# EAGLE design DAC Shield Rev B (EAGLE 9.6.2)

## Sheet 1 of 2
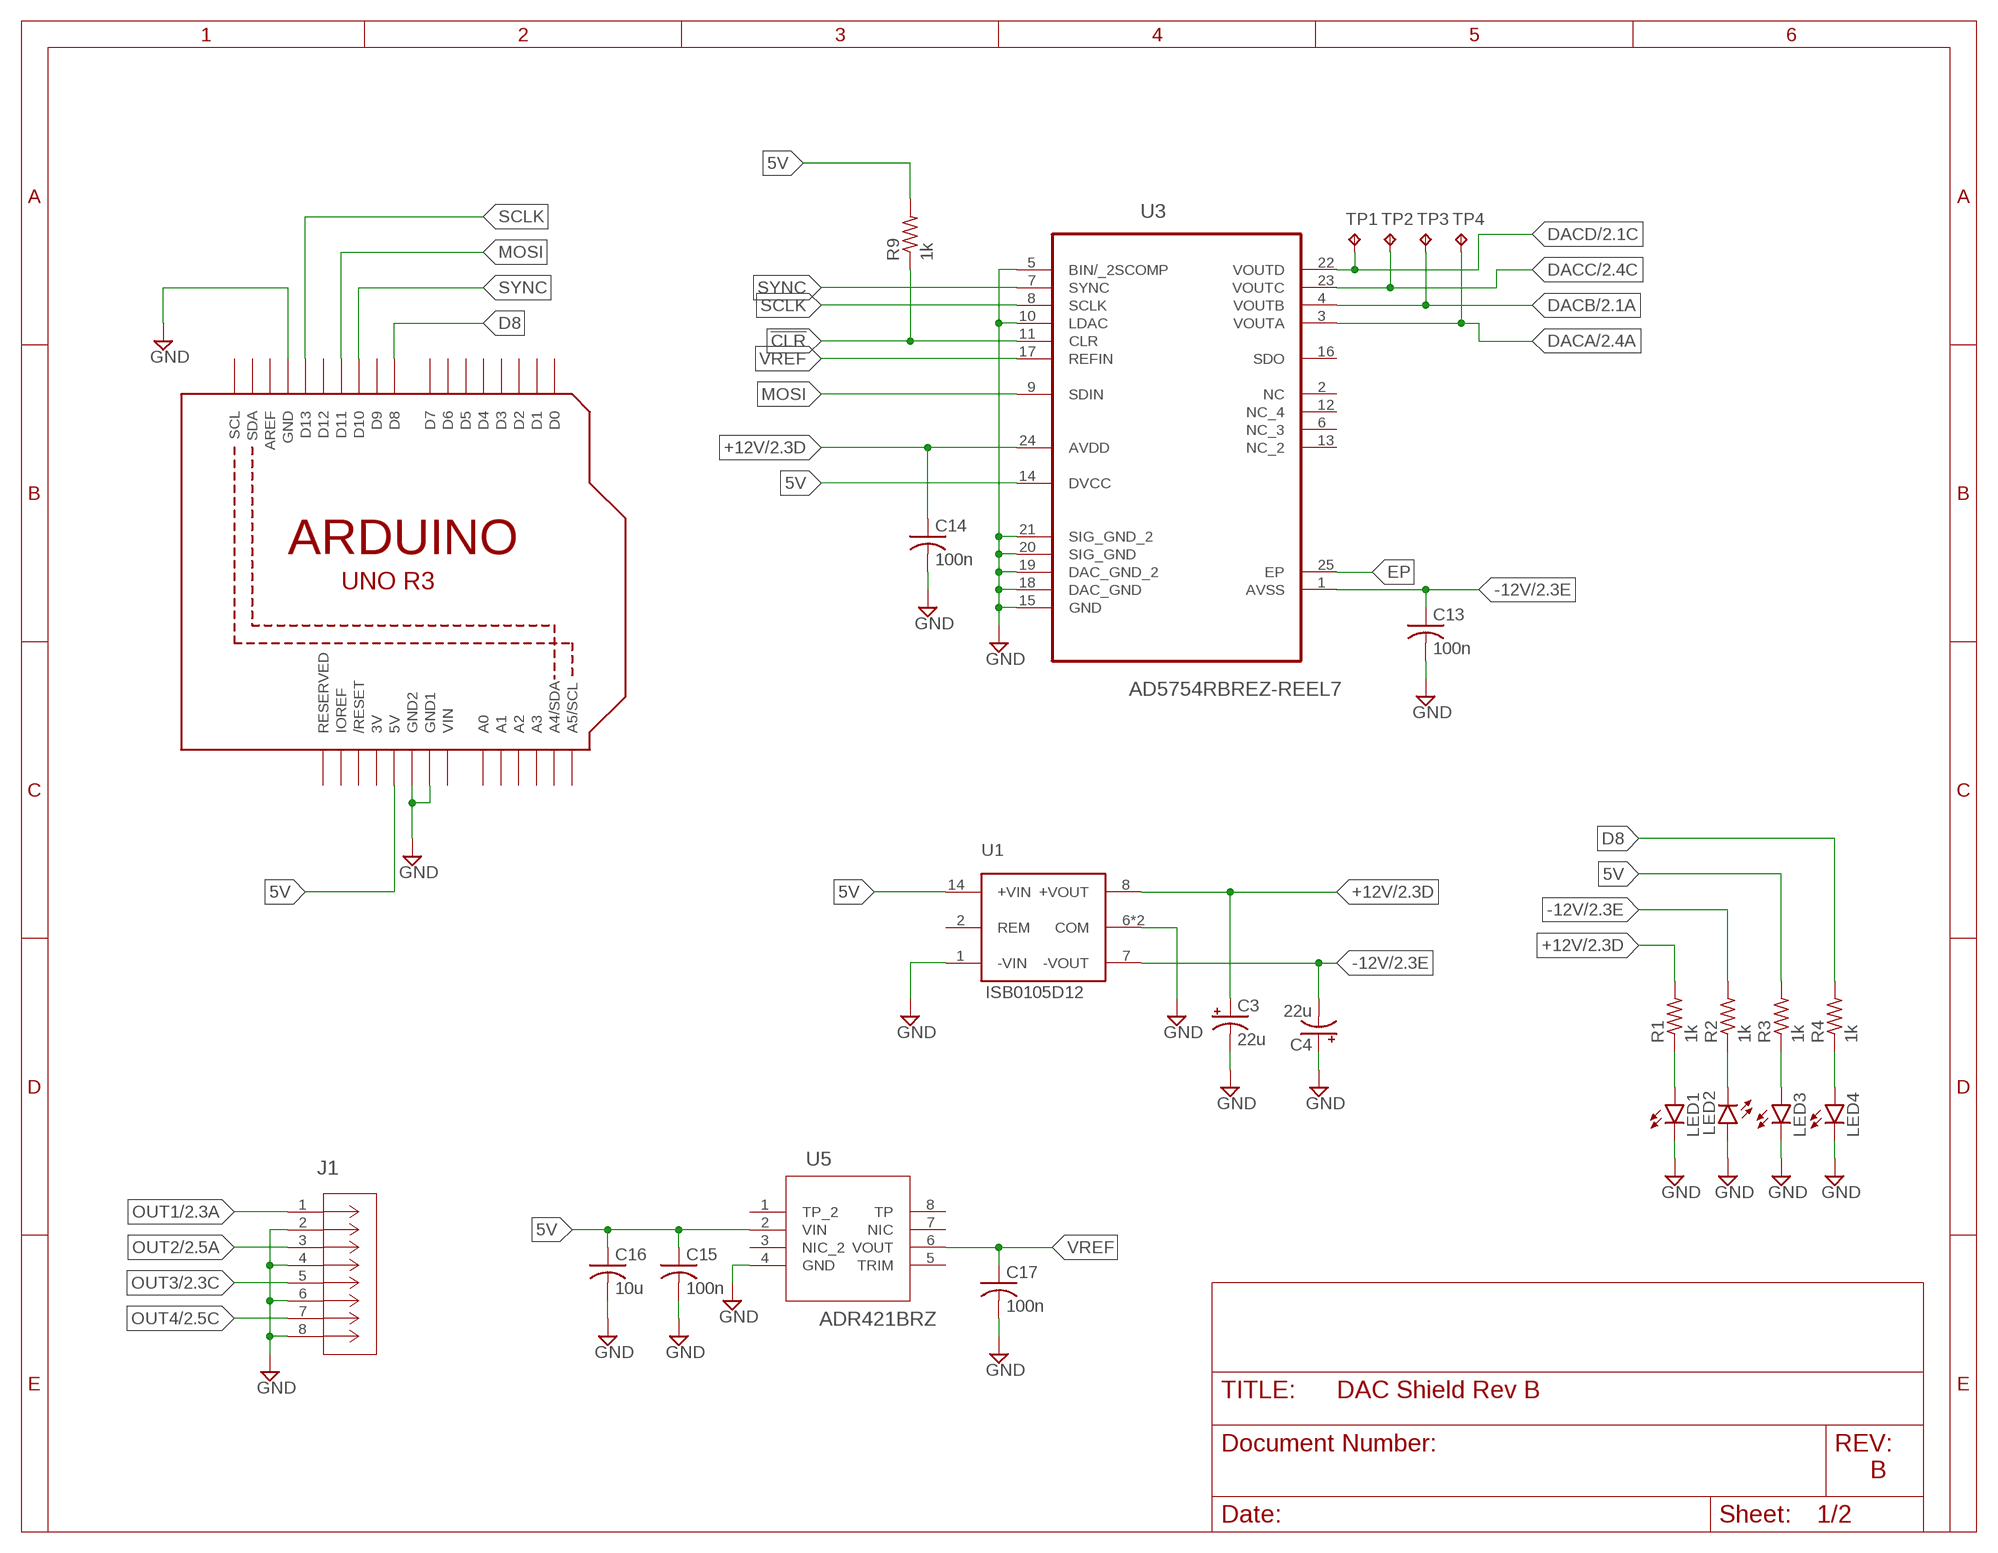
[diagram p0: schematic, sheet 1]

### Parts
C3  22u  CPOL-USC/6032-28W  [C/6032-28W]
C4  22u  CPOL-USC/6032-28W  [C/6032-28W]
C13  100n  C-USC0805  [C0805]
C14  100n  C-USC0805  [C0805]
C15  100n  C-USC0805  [C0805]
C16  10u  C-USC0805  [C0805]
C17  100n  C-USC0805  [C0805]
J1  OSTVN08A150  [CONN_OSTVN08A150_OST]
LED1  LEDCHIPLED_0805  [CHIPLED_0805]
LED2  LEDCHIPLED_0805  [CHIPLED_0805]
LED3  LEDCHIPLED_0805  [CHIPLED_0805]
LED4  LEDCHIPLED_0805  [CHIPLED_0805]
R1  1k  R-US_R0805  [R0805]
R2  1k  R-US_R0805  [R0805]
R3  1k  R-US_R0805  [R0805]
R4  1k  R-US_R0805  [R0805]
R9  1k  R-US_R0805  [R0805]
TP1  TPB1,27  [B1,27]
TP2  TPB1,27  [B1,27]
TP3  TPB1,27  [B1,27]
TP4  TPB1,27  [B1,27]
U1  ISB0105D12  ISB0105D12ISB0105D12  [SOP254P1860X845-14L]
U2  ARDUINOR3-BPLACE  [ARDUINOR3-BPLACE]
U3  AD5754RBREZ-REEL7  [SOP65P640X120-25N]
U5  ADR421BRZ  [R_8_ADI]

### Nets
5V: C15.1 C16.1 R3.2 R9.2 U1.14(+VIN) U2.5V U3.14(DVCC) U5.2(VIN)
!CLR: R9.1 U3.11(CLR)
+12V: C3.+ C14.1 R1.2 U1.8(+VOUT) U3.24(AVDD) ; also sheet 2
-12V: C4.- C13.1 R2.2 U1.7(-VOUT) U3.1(AVSS) ; also sheet 2
D8: R4.2 U2.D8
DACA: TP4.TP U3.3(VOUTA) ; also sheet 2
DACB: TP3.TP U3.4(VOUTB) ; also sheet 2
DACC: TP2.TP U3.23(VOUTC) ; also sheet 2
DACD: TP1.TP U3.22(VOUTD) ; also sheet 2
EP: U3.25(EP)
GND: C3.- C4.+ C13.2 C14.2 C15.2 C16.2 C17.2 J1.2 J1.4 J1.6 J1.8 LED1.C LED2.A LED3.C LED4.C U1.1(-VIN) U1.6(COM) U1.9(COM) U2.GND U2.GND1 U2.GND2 U3.5(BIN/_2SCOMP) U3.10(LDAC) U3.15(GND) U3.18(DAC_GND) U3.19(DAC_GND_2) U3.20(SIG_GND) U3.21(SIG_GND_2) U5.4(GND) ; also sheet 2
MOSI: U2.D11 U3.9(SDIN)
N$12: LED1.A R1.1
N$13: LED2.C R2.1
N$14: LED3.A R3.1
N$15: LED4.A R4.1
OUT1: J1.1 ; also sheet 2
OUT2: J1.3 ; also sheet 2
OUT3: J1.5 ; also sheet 2
OUT4: J1.7 ; also sheet 2
SCLK: U2.D13 U3.8(SCLK)
SYNC: U2.D10 U3.7(SYNC)
VREF: C17.1 U3.17(REFIN) U5.6(VOUT)
Unconnected: U1.2(REM) U2.A0 U2.A1 U2.A2 U2.A3 U2.A4(A4/SDA) U2.A5(A5/SCL) U2.AREF U2.D0 U2.D1 U2.D2 U2.D3 U2.D4 U2.D5 U2.D6 U2.D7 U2.D9 U2.D12 U2.IOREF U2.RESERVED U2.RESET(/RESET) U2.SCL U2.SDA U3.2(NC) U3.6(NC_3) U3.12(NC_4) U3.13(NC_2) U3.16(SDO) U5.1(TP_2) U5.3(NIC_2) U5.5(TRIM) U5.7(NIC) U5.8(TP)

### Notes on the sheet
- B

## Sheet 2 of 2
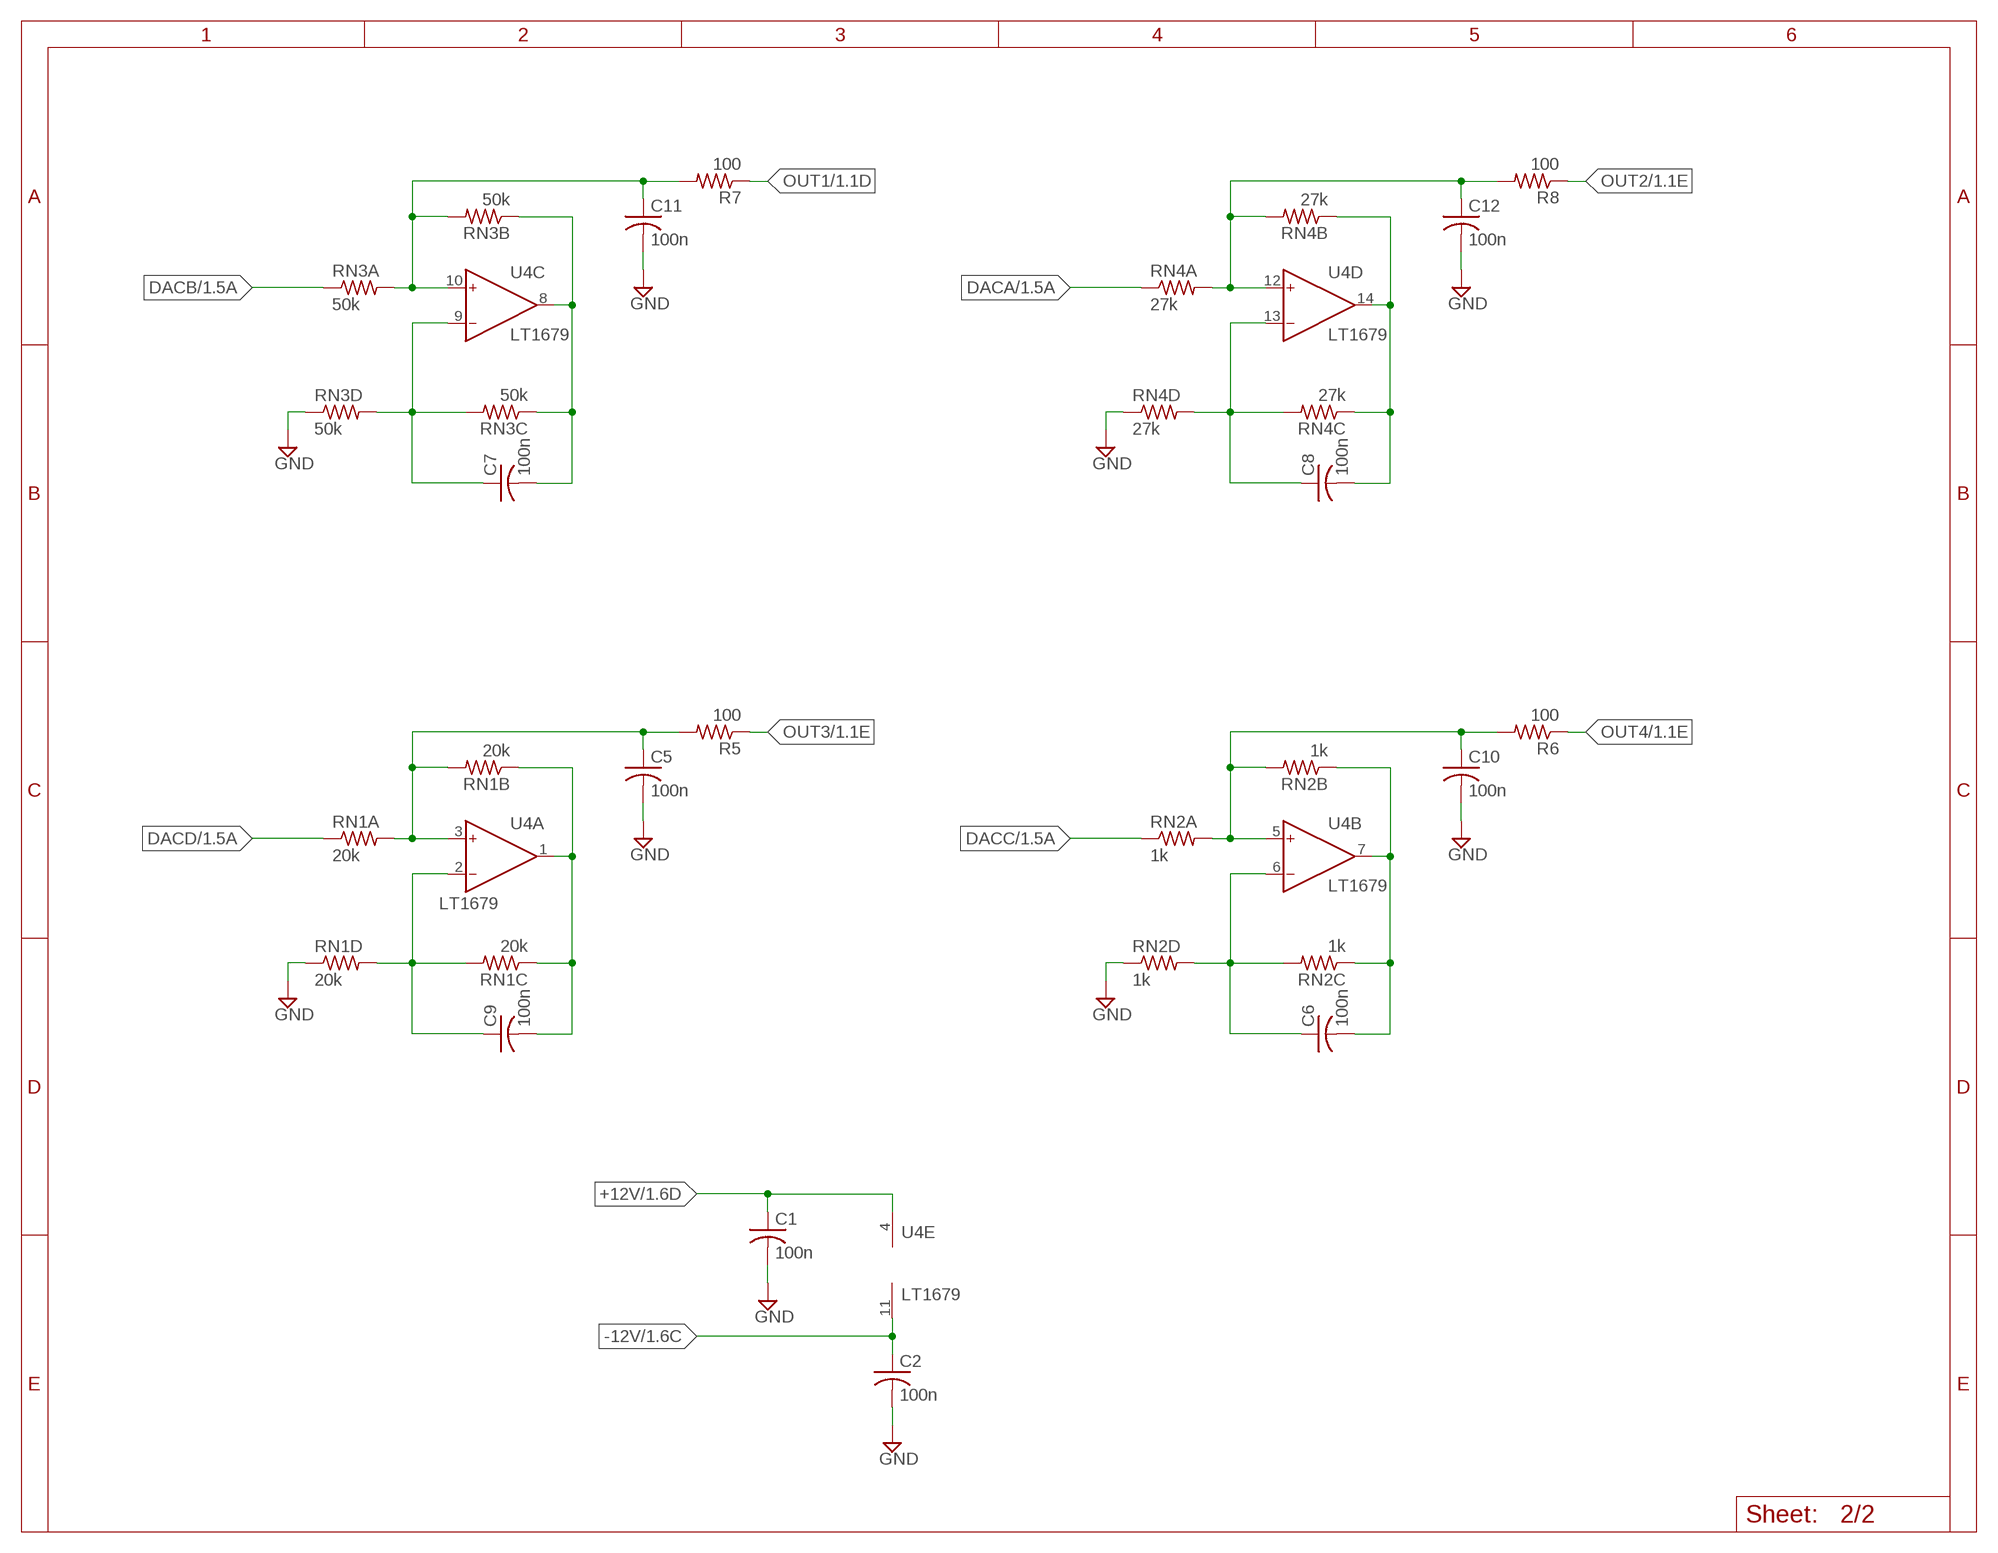
[diagram p1: schematic, sheet 2]

### Parts
C1  100n  C-USC0805  [C0805]
C2  100n  C-USC0805  [C0805]
C5  100n  C-USC0805  [C0805]
C6  100n  C-USC0805  [C0805]
C7  100n  C-USC0805  [C0805]
C8  100n  C-USC0805  [C0805]
C9  100n  C-USC0805  [C0805]
C10  100n  C-USC0805  [C0805]
C11  100n  C-USC0805  [C0805]
C12  100n  C-USC0805  [C0805]
R5  100  R-US_R0805  [R0805]
R6  100  R-US_R0805  [R0805]
R7  100  R-US_R0805  [R0805]
R8  100  R-US_R0805  [R0805]
RN1  20k  ACASA5001U5001P1ATACASA5001U5001P1AT  [RESCAV80P320X150X55-8N]
RN2  1k  ACASA5001U5001P1ATACASA5001U5001P1AT  [RESCAV80P320X150X55-8N]
RN3  50k  ACASA5001U5001P1ATACASA5001U5001P1AT  [RESCAV80P320X150X55-8N]
RN4  27k  ACASA5001U5001P1ATACASA5001U5001P1AT  [RESCAV80P320X150X55-8N]
U4  LT1679  AD8648ARZR_14_ADI-M  [R_14_ADI-M]

### Nets
+12V: C1.1 U4.4(E:V+) ; also sheet 1
-12V: C2.1 U4.11(E:V-) ; also sheet 1
DACA: RN4.1 ; also sheet 1
DACB: RN3.1 ; also sheet 1
DACC: RN2.1 ; also sheet 1
DACD: RN1.1 ; also sheet 1
GND: C1.2 C2.2 C5.2 C10.2 C11.2 C12.2 RN1.4 RN2.4 RN3.4 RN4.4 ; also sheet 1
N$1: C6.2 RN2.2 RN2.3 U4.7(B:OUT)
N$3: C6.1 RN2.5 RN2.6 U4.6(B:IN-)
N$4: C9.2 RN1.2 RN1.3 U4.1(A:OUT)
N$5: C10.1 R6.2 RN2.7 RN2.8 U4.5(B:IN+)
N$6: C7.2 RN3.2 RN3.3 U4.8(C:OUT)
N$7: C7.1 RN3.5 RN3.6 U4.9(C:IN-)
N$8: C8.2 RN4.2 RN4.3 U4.14(D:OUT)
N$9: C8.1 RN4.5 RN4.6 U4.13(D:IN-)
N$10: C9.1 RN1.5 RN1.6 U4.2(A:IN-)
N$11: C11.1 R7.2 RN3.7 RN3.8 U4.10(C:IN+)
N$16: C12.1 R8.2 RN4.7 RN4.8 U4.12(D:IN+)
N$18: C5.1 R5.2 RN1.7 RN1.8 U4.3(A:IN+)
OUT1: R7.1 ; also sheet 1
OUT2: R8.1 ; also sheet 1
OUT3: R5.1 ; also sheet 1
OUT4: R6.1 ; also sheet 1

### Notes on the sheet
- Sheet:

## Power pins joined to a net without a drawn wire
3V: U2.3V
VIN: U2.VIN

## Library data of the parts
C1 C2 C5-C17 = rcl:C-US: CAPACITOR, American symbol
C3 C4 = rcl:CPOL-US: POLARIZED CAPACITOR, American symbol
J1 = custom_connectors:OSTVN08A150; COPYRIGHT: Copyright (C) 2023 Ultra Librarian. All rights reserved.; MANUFACTURER_PART_NUMBER: OSTVN08A150; MFR_NAME: On Shore Technology
LED1-LED4 = led:LED: LED OSRAM: - CHIPLED LG R971, LG N971, LY N971, LG Q971, LY Q971, LO R971, LY R971 LH N974, LH R974 LS Q976, LO Q976, LY Q976 LO Q996 - Hyper CHIPLED LW Q18S LB Q993, LB Q99A, LB R99A - SideLED LS A670, LO A670, LY A670, LG A670, LP A670 LB A673, LV A673, LT A673, LW A673 LH A674 LY A675 LS A676, LA A676, LO A676, LY A676, LW A676 LS A679, LY A679, LG A679 - Hyper Micro SIDELED® LS Y876, LA Y876, LO Y876, LY Y876 LT Y87S - SmartLED LW L88C, LW L88S LB L89C, LB L89S, LG L890 LS L89K, LO L89K, LY L89K LS L896, LA L896, LO L896, LY L896 - TOPLED LS T670, LO T670, LY T670, LG T670, LP T670 LSG T670, LSP T670, LSY T670, LOP T670, LYG T670 LG T671, LOG T671, LSG T671 LB T673, LV T673, LT T673, LW T673 LH T674 LS T676, LA T676, LO T676, LY T676, LB T676, LH T676, LSB T676, LW T676 LB T67C, LV T67C, LT T67C, LS T67K, LO T67K, LY T67K, LW E67C LS E67B, LA E67B, LO E67B, LY E67B, LB E67C, LV E67C, LT E67C LW T67C LS T679, LY T679, LG T679 LS T770, LO T770, LY T770, LG T770, LP T770 LB T773, LV T773, LT T773, LW T773 LH T774 LS E675, LA E675, LY E675, LS T675 LS T776, LA T776, LO T776, LY T776, LB T776 LHGB T686 LT T68C, LB T68C - Hyper Mini TOPLED® LB M676 - Mini TOPLED Santana® LG M470 LS M47K, LO M47K, LY M47K Source: http://www.osram.convergy.de LUXEON: - LUMILED® LXK2-PW12-R00, LXK2-PW12-S00, LXK2-PW14-U00, LXK2-PW14-V00 LXK2-PM12-R00, LXK2-PM12-S00, LXK2-PM14-U00 LXK2-PE12-Q00, LXK2-PE12-R00, LXK2-PE12-S00, LXK2-PE14-T00, LXK2-PE14-U00 LXK2-PB12-K00, LXK2-PB12-L00, LXK2-PB12-M00, LXK2-PB14-N00, LXK2-PB14-P00, LXK2-PB14-Q00 LXK2-PR12-L00, LXK2-PR12-M00, LXK2-PR14-Q00, LXK2-PR14-R00 LXK2-PD12-Q00, LXK2-PD12-R00, LXK2-PD12-S00 LXK2-PH12-R00, LXK2-PH12-S00 LXK2-PL12-P00, LXK2-PL12-Q00, LXK2-PL12-R00 Source: www.luxeon.com KINGBRIGHT: KA-3528ASYC Source: www.kingbright.com
R1-R9 = rcl:R-US_: RESISTOR, American symbol
RN1-RN4 = rcl:ACASA5001U5001P1AT
TP1-TP4 = testpad:TP: Test pad
U1 = DC-DC:ISB0105D12
U2 = adafruit:ARDUINOR3: This is a new object for the new Arduino R3 - with extra pins that you may want to use (such as IOref, and duplicated A4/A5
U3 = AD5754RBREZ-REEL7:AD5754RBREZ-REEL7: IC, DAC, 16BIT, 100KSPS; MPN: AD5754RBREZ-REEL7; OC_FARNELL: 1776675; OC_NEWARK: 07P8940; PACKAGE: 24-Lead TSSOP_EP; SUPPLIER: Analog Devices
U4 = analog:AD8648ARZ; COPYRIGHT: Copyright (C) 2023 Ultra Librarian. All rights reserved.; MANUFACTURER_PART_NUMBER: AD8648ARZ; MFR_NAME: Analog Devices Inc
U5 = analog:ADR421BRZ; COPYRIGHT: Copyright (C) 2023 Ultra Librarian. All rights reserved.; MANUFACTURER_PART_NUMBER: ADR421BRZ; MFR_NAME: Analog Devices Inc

## Board
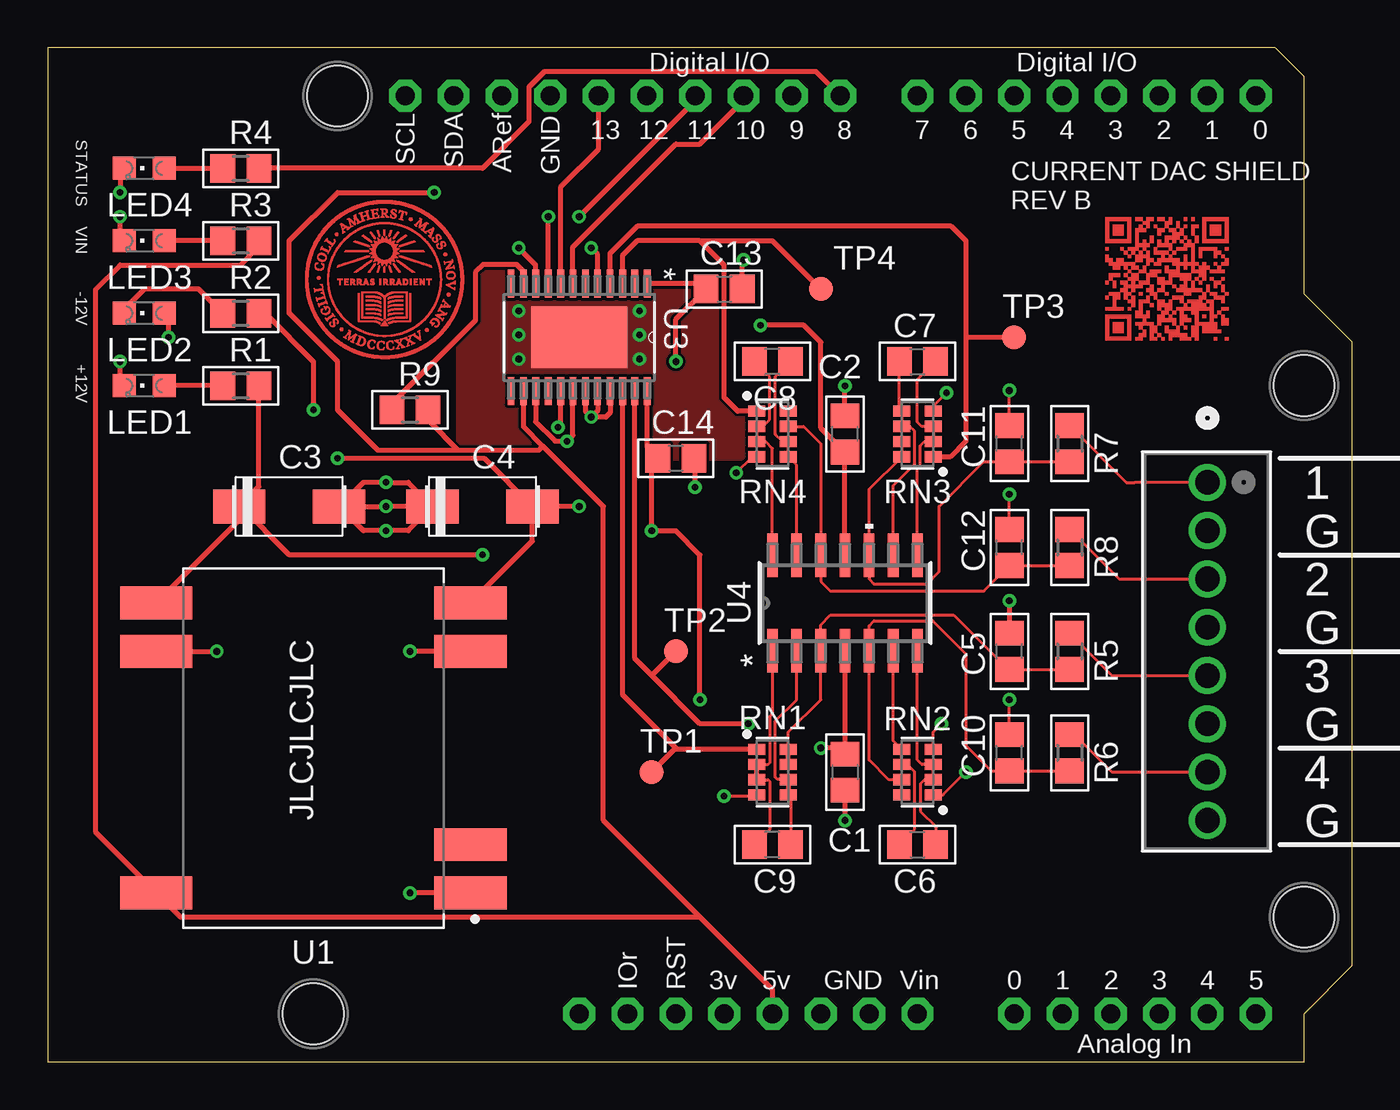
[diagram p2: board, top side]
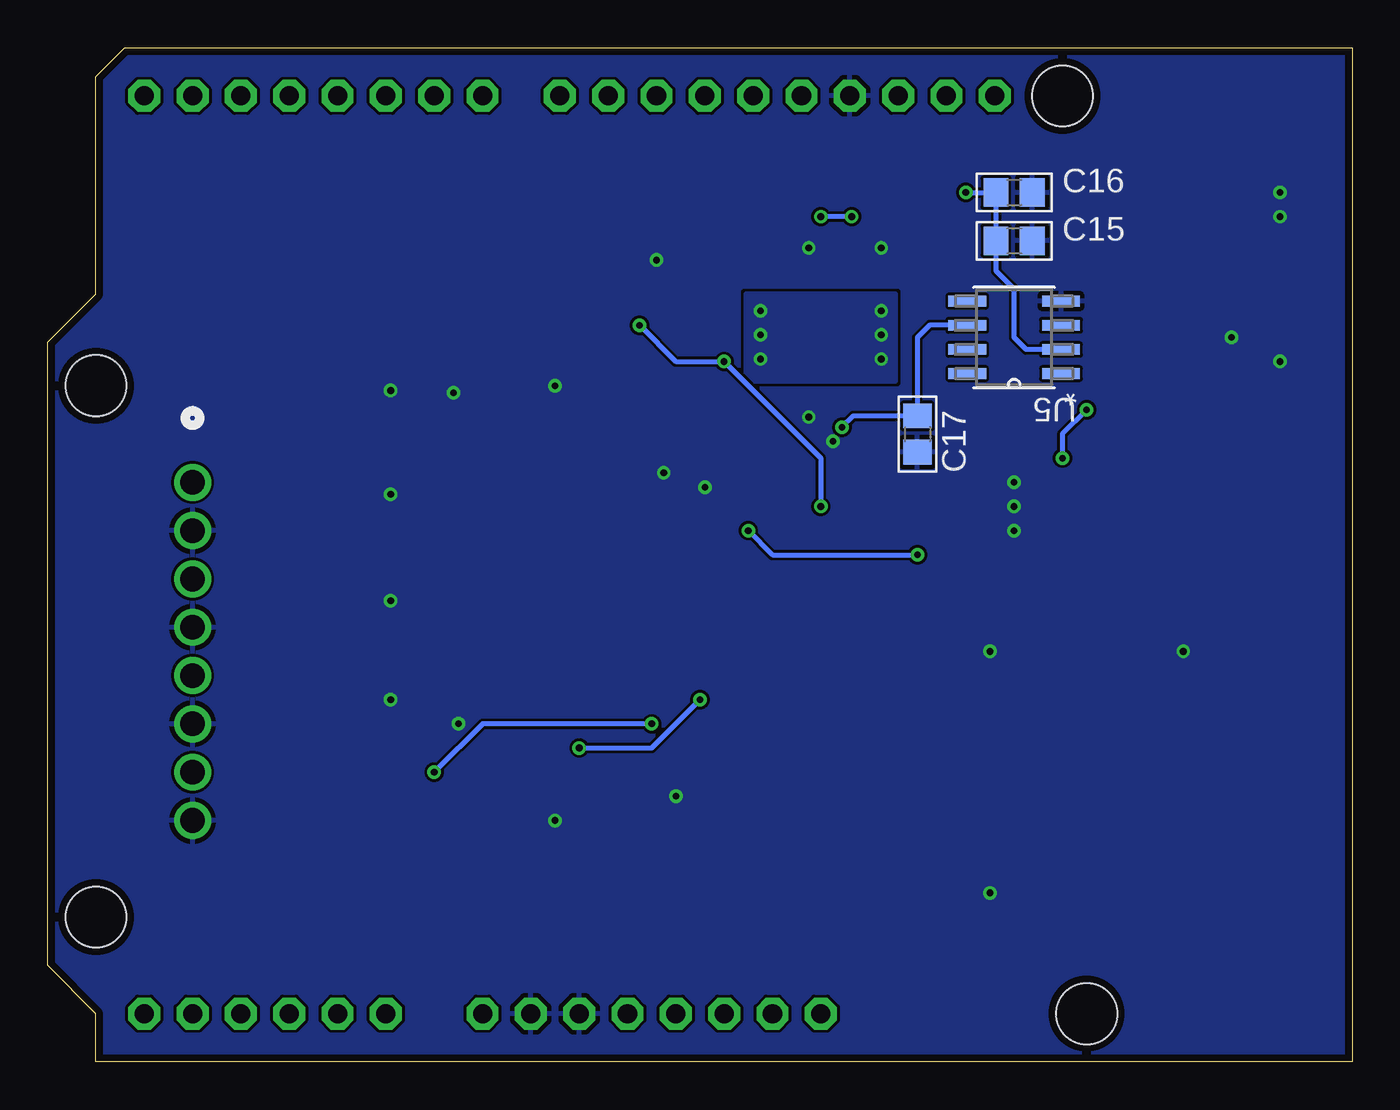
[diagram p3: board, bottom side, seen from below]

Size 68.58 x 53.34 mm. Coordinates in mm from the lower left corner, seen from the top.
Outline: 0,0 66.04,0 66.04,2.54 68.58,5.08 68.58,37.85 66.04,40.39 66.04,51.82 64.52,53.34 0,53.34 0,0
Copper layers (1*16): Top 0.0356mm / dielectric 1.5011mm / Bottom 0.0356mm
Design rules "oshpark-2layer *": minimum track width 6mil, minimum drill 13mil, track to track 6mil, track to pad 6mil, pad to pad 6mil, via to via 6mil, smd to smd 6mil, copper to edge 15mil, drill to drill 6mil, minimum pad ring 7mil, minimum via ring 7mil, stop-mask expansion 2.5mil, vias tented up to drill 20mil, thermal gap 10mil

### Footprints (pad centres in the part's own frame; a part is rotated, then mirrored left to right if it is on the bottom)
C0805 = smd 1.3 x 1.5: 1 -0.95,0; 2 0.95,0
C/6032-28W = smd 2.75 x 1.8: + 2.625,0; - -2.625,0
CONN_OSTVN08A150_OST = drill 1.295 pad 1.803: 1 0,0; 2 2.54,0; 3 5.08,0; 4 7.62,0; 5 10.16,0; 6 12.7,0; 7 15.24,0; 8 17.78,0
CHIPLED_0805 = smd 1.2 x 1.2: A 0,-1.05; C 0,1.05
R0805 = smd 1.3 x 1.5: 1 -0.95,0; 2 0.95,0
RESCAV80P320X150X55-8N = smd 0.901 x 0.589: 1 -0.835,1.2; 2 -0.835,0.4; 3 -0.835,-0.4; 4 -0.835,-1.2; 5 0.835,-1.2; 6 0.835,-0.4; 7 0.835,0.4; 8 0.835,1.2
B1,27 = smd 1.27 x 1.27: TP 0,0
SOP254P1860X845-14L = smd 3.788 x 1.732: 1 -8.257,7.62; 2 -8.257,5.08; 6 -8.257,-5.08; 7 -8.257,-7.62; 8 8.257,-7.62; 9 8.257,-5.08; 14 8.257,7.62
ARDUINOR3-BPLACE = drill 1 pad 1.676 octagon: 3V 35.56,2.54; 5V 38.1,2.54; A0 50.8,2.54; A1 53.34,2.54; A2 55.88,2.54; A3 58.42,2.54; A4 60.96,2.54; A5 63.5,2.54; AREF 23.876,50.8; D0 63.5,50.8; D1 60.96,50.8; D2 58.42,50.8; D3 55.88,50.8; D4 53.34,50.8; D5 50.8,50.8; D6 48.26,50.8; D7 45.72,50.8; D8 41.656,50.8; D9 39.116,50.8; D10 36.576,50.8; D11 34.036,50.8; D12 31.496,50.8; D13 28.956,50.8; GND 26.416,50.8; GND1 43.18,2.54; GND2 40.64,2.54; IOREF 30.48,2.54; RESERVED 27.94,2.54; RESET 33.02,2.54; SCL 18.796,50.8; SDA 21.336,50.8; VIN 45.72,2.54 | hole 3.2: 15.24,50.8; 13.97,2.54; 66.04,7.62; 66.04,35.56
SOP65P640X120-25N = smd 1.473 x 0.356: 1 -2.819,3.581; 2 -2.819,2.921; 3 -2.819,2.286; 4 -2.819,1.626; 5 -2.819,0.965; 6 -2.819,0.33; 7 -2.819,-0.33; 8 -2.819,-0.965; 9 -2.819,-1.626; 10 -2.819,-2.286; 11 -2.819,-2.921; 12 -2.819,-3.581; 13 2.819,-3.581; 14 2.819,-2.921; 15 2.819,-2.286; 16 2.819,-1.626; 17 2.819,-0.965; 18 2.819,-0.33; 19 2.819,0.33; 20 2.819,0.965; 21 2.819,1.626; 22 2.819,2.286; 23 2.819,2.921; 24 2.819,3.581 | smd 3.251 x 5.029: 25 0,0
R_14_ADI-M = smd 2.286 x 0.561: 1 -2.516,3.81; 2 -2.516,2.54; 3 -2.516,1.27; 4 -2.516,0; 5 -2.516,-1.27; 6 -2.516,-2.54; 7 -2.516,-3.81; 8 2.516,-3.81; 9 2.516,-2.54; 10 2.516,-1.27; 11 2.516,0; 12 2.516,1.27; 13 2.516,2.54; 14 2.516,3.81
R_8_ADI = smd 1.981 x 0.559: 1 -2.464,1.905; 2 -2.464,0.635; 3 -2.464,-0.635; 4 -2.464,-1.905; 5 2.464,-1.905; 6 2.464,-0.635; 7 2.464,0.635; 8 2.464,1.905

### Placement (x,y rotation side)
C1  41.91,15.24 270 top
C2  41.91,33.02 90 top
C3  12.7,29.21 180 top
C4  22.86,29.21 180 top
C5  50.55,21.59 90 top
C6  45.72,11.43 0 top
C7  45.72,36.83 0 top
C8  38.1,36.83 180 top
C9  38.1,11.43 180 top
C10  50.55,16.26 90 top
C11  50.55,32.51 90 top
C12  50.55,27.05 90 top
C13  35.56,40.64 0 top
C14  33.02,31.75 0 top
C15  17.78,43.18 0 bottom
C16  17.78,45.72 0 bottom
C17  22.86,33.02 270 bottom
J1  60.96,30.48 270 top
LED1  5.08,35.56 90 top
LED2  5.08,39.37 90 top
LED3  5.08,43.18 90 top
LED4  5.08,46.99 90 top
R1  10.16,35.56 0 top
R2  10.16,39.37 0 top
R3  10.16,43.18 0 top
R4  10.16,46.99 0 top
R5  53.72,21.59 270 top
R6  53.72,16.26 270 top
R7  53.72,32.51 270 top
R8  53.72,27.05 270 top
R9  19.05,34.29 0 top
RN1  38.1,15.24 0 top
RN2  45.72,15.24 180 top
RN3  45.72,33.02 180 top
RN4  38.1,33.02 0 top
TP1  31.75,15.24 0 top
TP2  33.02,21.59 0 top
TP3  50.8,38.1 0 top
TP4  40.64,40.64 180 top
U1  13.97,16.51 180 top
U2  0,0 0 top
U3  27.94,38.1 270 top
U4  41.91,24.13 90 top
U5  17.78,38.1 180 bottom

### Tracks (layer width: path | path; a pad name or v marks a point on that pad's centre or on a via)
5V  (via drill 0.35)
  Top 0.254: U3.14 25.02,33.4 26.04,32.38 | 34.29,7.62 29.21,12.7 29.21,29.21 26.04,32.38 | 34.29,7.62 38.1,3.81 U2.5V | R9.2 20,33.75 21.59,32.16 | 21.59,32.16 25.81,32.16 26.04,32.38 | 21.59,32.16 17.37,32.16 15.24,34.29 15.24,36.83 12.7,39.37 12.7,43.18 15.24,45.72 v20.32,45.72 | R3.2 11.11,42.86 10.16,41.91 3.81,41.91 2.54,40.64 2.54,12.06 U1.14 6.98,7.62 34.29,7.62
  Bottom 0.254: U5.2 17.14,37.47 17.78,38.1 17.78,40.64 18.73,41.59 C15.1 C16.1 v20.32,45.72
!CLR
  Top 0.254: U3.11 25.02,41.57 24.65,41.94 22.89,41.94 22.48,41.53 22.48,38.99 18.1,34.61 R9.1
+12V  (via drill 0.35)
  Top 0.254: U1.8 10.07,28.49 C3.+ 10.12,29.25 | 10.12,29.25 11.11,30.25 R1.2 | U4.4 C1.1 41.59,16.51 v40.64,16.51 | v22.86,26.67 12.7,26.67 10.12,29.25 | v34.29,19.05 34.29,26.67 33.02,27.94 v31.75,27.94 31.75,31.43 C14.1 31.52,32.3 U3.24
  Bottom 0.254: v31.75,27.94 30.48,26.67 v22.86,26.67 | v40.64,16.51 36.83,16.51 v34.29,19.05
-12V  (via drill 0.35)
  Top 0.254: R2.2 11.43,39.37 13.97,36.83 v13.97,34.29 | U1.7 25.48,27.39 C4.- | v15.24,31.75 22.95,31.75 C4.- | v27.94,29.21 C4.- | U4.11 C2.1 40.64,33.34 40.64,37.85 39.75,38.73 v37.47,38.73 | v33.02,36.83 33.02,39.05 C13.1 34.33,40.92 U3.1
  Bottom 0.254: v13.97,34.29 15.24,33.02 v15.24,31.75 | v27.94,29.21 27.94,31.75 v33.02,36.83 35.56,36.83 v37.47,38.73
D8
  Top 0.254: U2.D8 40.39,52.07 26.11,52.07 25.3,51.26 25.3,49.43 22.86,46.99 R4.2
DACA
  Top 0.254: 34.29,43.18 30.99,43.18 30.23,42.42 U3.3 | 34.29,43.18 35.56,41.91 35.56,34.92 36.27,34.22 RN4.1 | 34.29,43.18 38.1,43.18 TP4.TP
DACB
  Top 0.254: RN3.1 47.44,31.82 48.26,32.64 48.26,38.1 | 48.26,38.1 48.26,43.18 47.5,43.94 30.99,43.94 29.57,42.52 U3.4 | TP3.TP 48.26,38.1
DACC  (via drill 0.35)
  Top 0.152: RN2.1 47.06,14.04 v48.26,15.24
  Top 0.254: v36.83,17.78 34.29,17.78 31.75,20.32 | 31.75,20.32 30.86,21.21 U3.23 | TP2.TP 31.75,20.32
  Bottom 0.254: v48.26,15.24 45.72,17.78 v36.83,17.78
DACD
  Top 0.254: 33.02,16.51 33.09,16.44 RN1.1 | 33.02,16.51 30.23,19.3 U3.22 | TP1.TP 33.02,16.51
EP  (via drill 0.35)
  other vias: 24.77,39.5 24.77,38.23 24.77,36.96 31.11,36.96 31.11,38.23 31.11,39.5
  pour Top (no thermals): 21.59,44.45 21.59,31.75 36.83,31.75 36.83,44.45
  pour Bottom (no thermals): 31.88,40.39 31.88,35.81 24,35.81 24,40.39
GND  (via drill 0.35)
  Top 0.152: RN1.4 37.2,13.97 v35.56,13.97 | RN2.4 46.55,17.34 v46.99,17.78 | C10.2 v50.55,19.05 | RN3.4 46.55,34.49 v47.24,35.18 | C11.2 v50.55,35.31 | C12.2 v50.55,29.84 | v36.2,30.99 37.03,31.82 RN4.4
  Top 0.254: U1.9 v8.89,21.59 | U1.6 v19.05,21.59 | U1.1 v19.05,8.89 | C4.+ v17.78,29.21 C3.- | C3.- 16.59,30.48 v17.78,30.48 18.96,30.48 C4.+ | C4.+ 18.96,27.94 v17.78,27.94 16.59,27.94 C3.- | LED1.C 3.81,35.78 v3.81,36.83 | LED2.A 6.35,39.15 v6.35,38.1 | LED3.C 3.81,43.4 v3.81,44.45 | LED4.C 3.81,46.77 v3.81,45.72 | C1.2 v41.91,12.7 | v50.55,24.26 C5.2 | C2.2 v41.91,35.56 | U3.19 28.27,34.21 v28.57,33.91 | U3.20 28.91,34.24 v28.57,33.91 | U3.21 29.57,34.14 29.34,33.91 v28.57,33.91 | U3.18 27.61,32.94 v27.3,32.64 26.67,32.64 25.65,33.66 U3.15 | U3.10 25.65,41.91 v24.77,42.8 | U3.5 28.91,42.47 v28.57,42.8 | v34.04,30.23 34.04,31.68 C14.2 | C13.2 36.51,42.1 v36.58,42.16
  pour Bottom (rank 2): 0,0 0,53.34 64.52,53.34 66.04,51.82 66.04,40.39 68.58,37.85 68.58,5.08 66.04,2.54 66.04,0
MOSI  (via drill 0.35)
  Top 0.254: U3.9 v26.31,44.45 v26.32,44.45 | v27.94,44.45 34.04,50.55 U2.D11
  Bottom 0.254: v26.32,44.45 v27.94,44.45
N$1
  Top 0.152: C6.2 46.67,12.38 45.88,13.18 45.88,14.63 46.08,14.84 RN2.2 RN2.3 45.95,15.64 45.72,15.88 U4.7
N$3
  Top 0.152: U4.6 44.45,16.88 RN2.5 RN2.6 45.19,15.64 45.57,15.26 45.57,12.23 C6.1
N$4
  Top 0.152: U4.1 38.1,18.29 37.94,18.13 37.94,15.72 37.85,15.62 37.28,15.62 RN1.2 | 37.59,14.86 37.28,14.86 RN1.3 37.87,14.84 37.97,14.73 37.97,12.25 C9.2
  Top 0.254: RN1.3 37.27,14.86 | 37.27,14.86 RN1.2 | 37.59,14.86 37.27,14.86
N$5
  Top 0.152: RN2.8 RN2.7 44.22,14.84 43.18,15.88 U4.5 43.18,22.94 43.43,23.19 46.53,23.19 48.26,21.46 48.26,16.64 49.59,15.31 C10.1 R6.2
N$6
  Top 0.152: U4.8 45.72,31.16 45.87,31.3 45.87,32.41 46.08,32.62 RN3.2 RN3.3 45.95,33.42 45.72,33.66 45.72,35.88 C7.2
N$7
  Top 0.152: U4.9 44.45,30.32 45.56,31.43 45.56,33.18 45.32,33.42 RN3.6 RN3.5 44.77,34.34 C7.1
N$8
  Top 0.152: U4.14 38.1,32.26 37.74,32.62 RN4.3 RN4.2 37.59,33.42 37.95,33.78 37.95,36.03 C8.2
N$9
  Top 0.152: U4.13 39.37,31.39 RN4.5 RN4.6 38.63,32.62 38.26,32.99 38.26,36.04 C8.1
N$10
  Top 0.152: RN1.6 38.92,14.86 38.35,14.86 38.25,14.96 38.25,17.93 39.37,19.05 U4.2 | RN1.5 39.05,13.93 C9.1
  Top 0.254: RN1.6 RN1.5
N$11
  Top 0.152: RN3.7 RN3.8 43.18,30.11 U4.10 43.18,25.4 43.43,25.15 46.23,25.15 46.86,25.78 46.86,29.21 49.22,31.56 C11.1 R7.2
N$12
  Top 0.254: R1.1 LED1.A
N$13
  Top 0.254: R2.1 7.94,40.64 5.08,40.64 4.03,39.59 LED2.C
N$14
  Top 0.254: R3.1 LED3.A
N$15
  Top 0.254: LED4.A R4.1
N$16
  Top 0.152: RN4.8 RN4.7 39.73,33.42 40.64,32.51 U4.12 40.64,25.27 41.15,24.77 49.21,24.77 C12.1 R8.2
N$18
  Top 0.152: R5.2 C5.1 50.48,20.64 47.62,23.5 41.15,23.5 40.64,22.99 U4.3 40.64,19.05 38.94,17.34 RN1.8
  Top 0.254: RN1.7 RN1.8
OUT1
  Top 0.152: J1.1 57.15,30.48 56.7,30.48 R7.1
OUT2
  Top 0.152: J1.3 56.32,25.4 R8.1
OUT3
  Top 0.152: J1.5 55.94,20.32 R5.1
OUT4
  Top 0.152: J1.7 55.94,15.24 53.98,17.21 R6.1
SCLK
  Top 0.254: U3.8 26.98,46.02 28.96,48.01 U2.D13
SYNC
  Top 0.254: U3.7 27.61,42.85 33.02,48.26 34.29,48.26 36.58,50.55 U2.D10
VREF  (via drill 0.35)
  Top 0.254: v26.83,33.38 26.98,33.52 U3.17
  Bottom 0.254: U5.6 22.23,38.73 22.86,38.1 C17.1 26.23,33.97 v26.83,33.38
(copper drawn outside any net)
  shapes: Top area x15772

### Text on the board
tPlace: STATUS | CURRENT DAC SHIELD / REV B | VIN | -12V | +12V | 1 | G | 2 | G | 3 | G | 4 | JLCJLCJLC | G